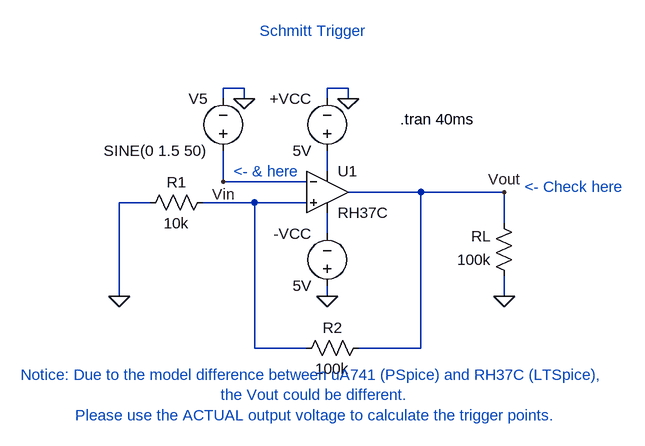
[diagram p0: schematic HLab02_Schmitt_triangle.asc]
HLab02_Schmitt_triangle.asc, the LTspice schematic file:
Version 4
SHEET 1 1100 704
WIRE 64 160 32 160
WIRE 224 160 192 160
WIRE 32 176 32 160
WIRE 64 176 64 160
WIRE 192 176 192 160
WIRE 224 176 224 160
WIRE 192 288 192 256
WIRE 32 304 32 256
WIRE 160 304 32 304
WIRE 336 320 224 320
WIRE 464 320 336 320
WIRE -80 336 -128 336
WIRE 80 336 0 336
WIRE 160 336 80 336
WIRE 464 368 464 320
WIRE 192 384 192 352
WIRE -128 480 -128 336
WIRE 192 480 192 464
WIRE 464 480 464 448
WIRE 80 560 80 336
WIRE 160 560 80 560
WIRE 336 560 336 320
WIRE 336 560 240 560
FLAG 224 176 0
FLAG 192 480 0
FLAG 64 176 0
FLAG -128 480 0
FLAG 464 480 0
FLAG 464 320 Vout
FLAG 32 304 Vin
SYMBOL voltage 192 480 R180
WINDOW 0 24 96 Left 2
WINDOW 3 24 16 Left 2
SYMATTR InstName -VCC
SYMATTR Value 5V
SYMBOL voltage 192 272 R180
WINDOW 0 24 96 Left 2
WINDOW 3 24 16 Left 2
SYMATTR InstName +VCC
SYMATTR Value 5V
SYMBOL voltage 32 272 R180
WINDOW 0 24 96 Left 2
WINDOW 3 24 16 Left 2
SYMATTR InstName V5
SYMATTR Value SINE(0 1.5 50)
SYMBOL res 16 320 R90
WINDOW 0 0 56 VBottom 2
WINDOW 3 32 56 VTop 2
SYMATTR InstName R1
SYMATTR Value 10k
SYMBOL res 256 544 R90
WINDOW 0 0 56 VBottom 2
WINDOW 3 32 56 VTop 2
SYMATTR InstName R2
SYMATTR Value 100k
SYMBOL res 480 464 R180
WINDOW 0 36 76 Left 2
WINDOW 3 36 40 Left 2
SYMATTR InstName RL
SYMATTR Value 100k
SYMBOL Opamps/RH37C 192 256 R0
SYMATTR InstName U1
TEXT 304 208 Left 2 !.tran 40ms
TEXT 88 72 Left 2 ;Schmitt Trigger
TEXT 496 312 Left 2 ;<- Check here
TEXT 48 288 Left 2 ;<- & here
TEXT 176 632 Center 2 ;Notice: Due to the model difference between uA741 (PSpice) and RH37C (LTSpice), \nthe Vout could be different. \nPlease use the ACTUAL output voltage to calculate the trigger points.

The netlist it stands for:
* HLab02_Schmitt_triangle.asc
V§-VCC 0 N003 5V
V§+VCC N001 0 5V
V5 Vin 0 SINE(0 1.5 50)
R1 N002 0 10k
R2 Vout N002 100k
RL 0 Vout 100k
XU1 N002 Vin N001 N003 Vout RH37C  ; pins In+ In- V+ V- OUT
.tran 40ms
* Schmitt Trigger
* <- Check here
* <- & here
* Notice: Due to the model difference between uA741 (PSpice) and RH37C (LTSpice),
* the Vout could be different.
* Please use the ACTUAL output voltage to calculate the trigger points.
.backanno
.end